# EAGLE board Replicape_B4 (EAGLE 9.5.1), part 1 of 2
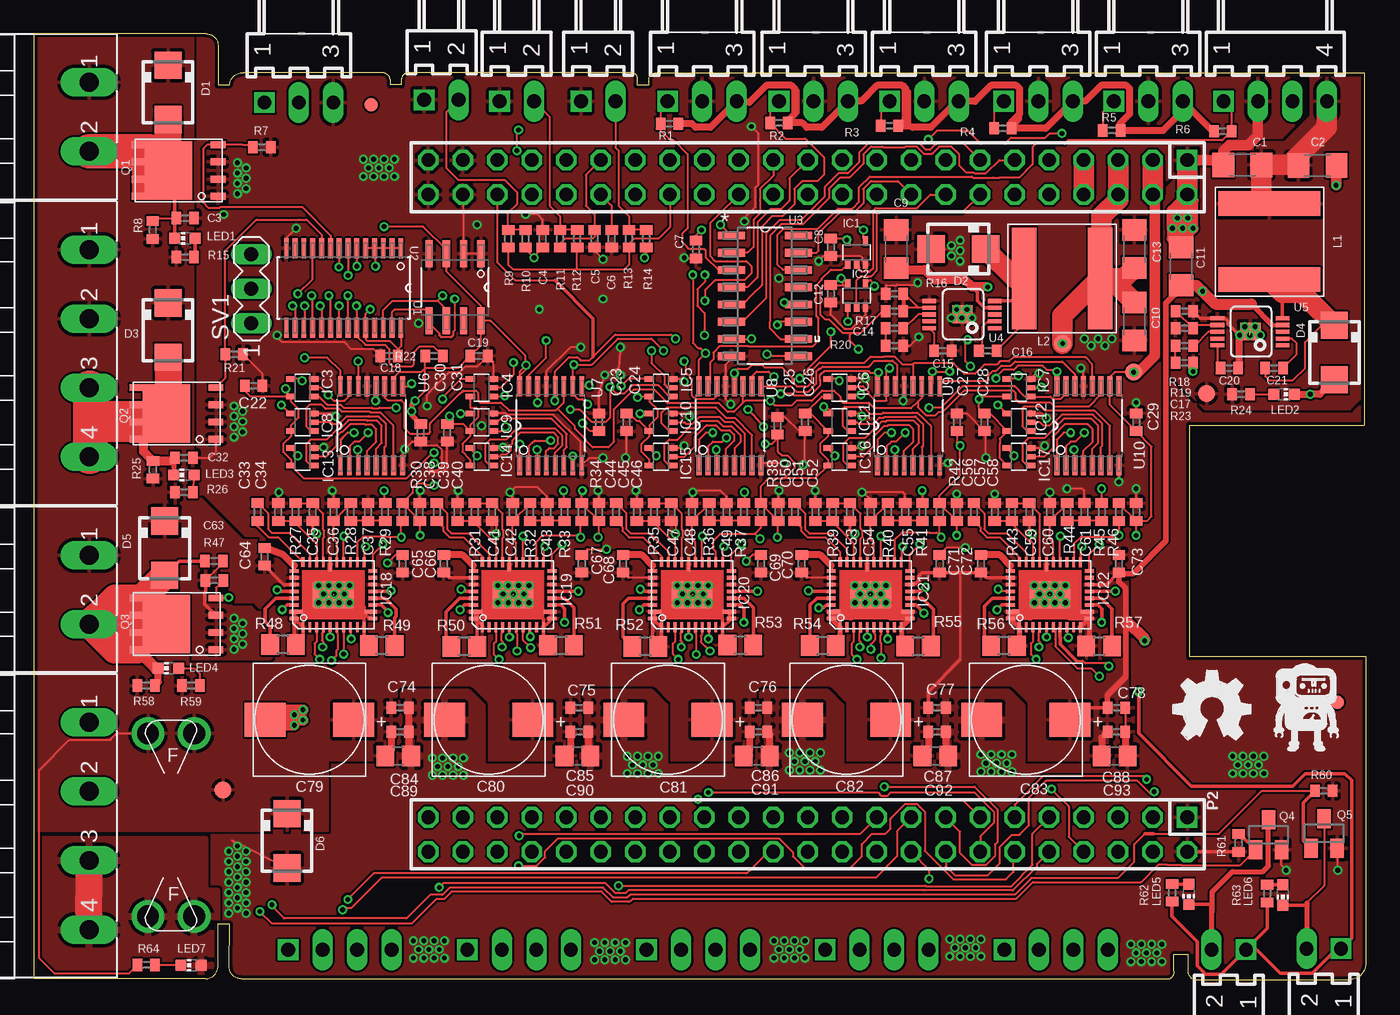
[diagram p7: board, top side]
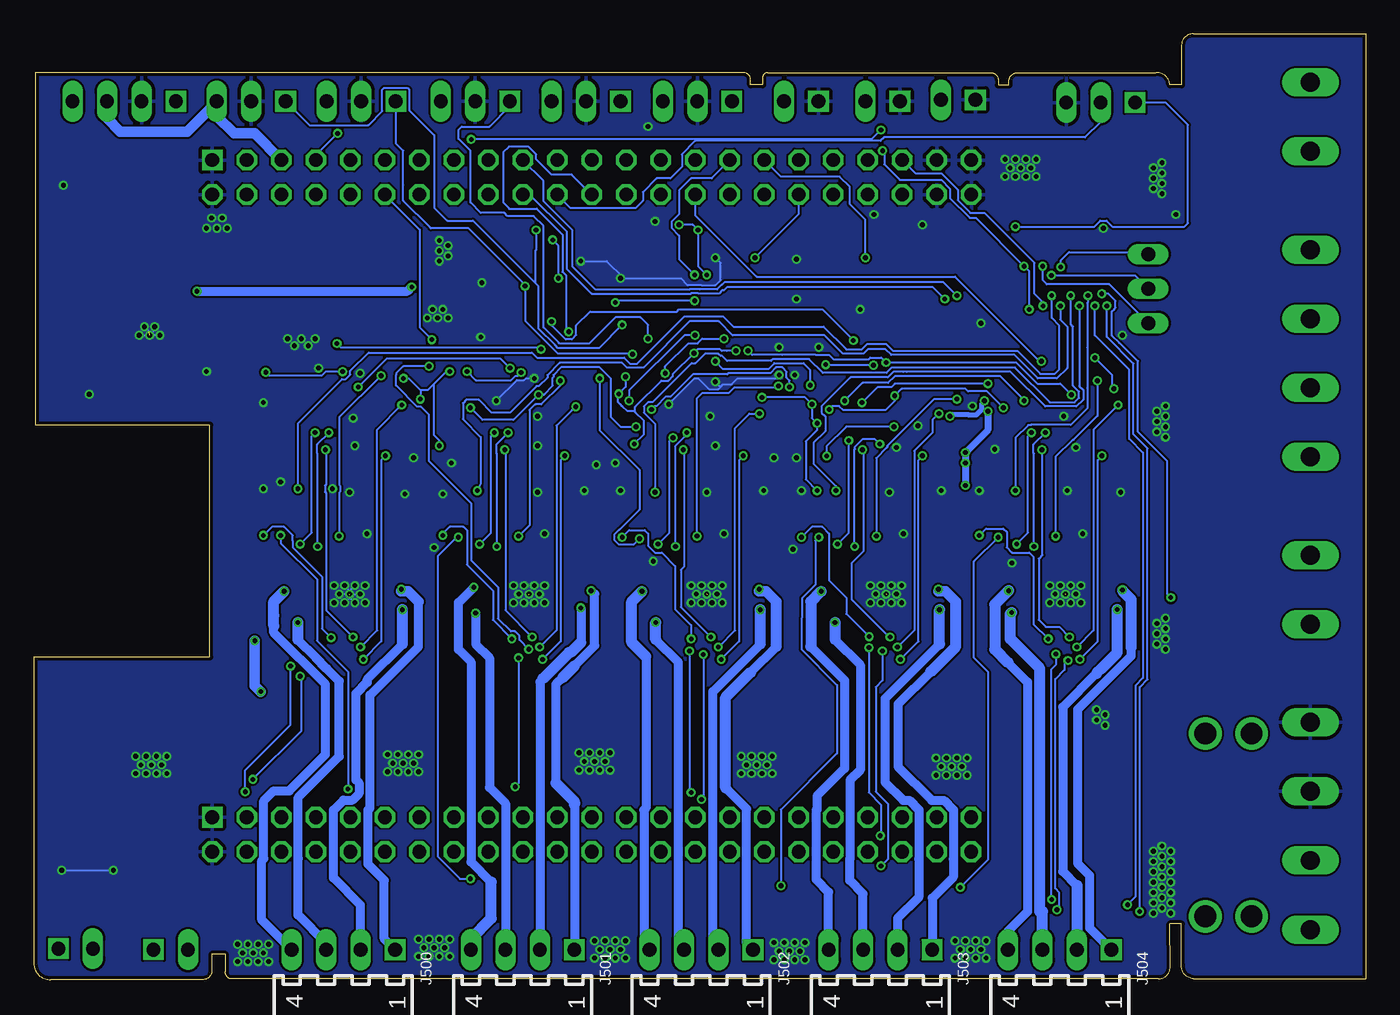
[diagram p8: board, bottom side, seen from below]

Size 98.05 x 69.6 mm. Coordinates in mm from the lower left corner, seen from the top.
Outline: 13.55,4.1 14.4,4.1 14.38,0.9 arc90 15.28,0.05 83.55,0.05 arc90 83.95,0.6 83.95,1.85 84.95,1.85 84.95,0.65 arc90 85.55,0 96.8,0 arc90 98.05,1.1 98.05,23.75 85.1,23.75 85.1,40.8 97.95,40.8 97.95,66.75 45.78,66.75 arc90 45.28,66.2 45.28,65.85 44.4,65.85 44.4,66.35 arc90 44.05,66.75 27.6,66.75 arc90 27.05,66.25 27.05,65.85 26.25,65.85 26.25,66.1 arc90 25.65,66.75 15.45,66.75 arc90 14.4,65.85 13.55,65.85 13.55,68.8 arc90 12.7,69.6 0,69.6 0,0.05 12.7,0.05 arc90 13.55,1.1 13.55,4.1
Copper layers (1*16): Top 0.035mm / dielectric 0.2mm / Bottom 0.035mm
Design rules "default *": minimum track width 6mil, minimum drill 0.3mm, track to track 6mil, track to pad 6mil, pad to pad 6mil, via to via 6mil, smd to smd 0mil, copper to edge 10mil, drill to drill 10mil, minimum pad ring 10mil, minimum via ring 6mil, stop-mask expansion 2mil, vias tented up to drill 100mil, thermal gap 10mil
Net classes: 1 power: width 1.27 mm

## Footprints (pad centres in the part's own frame; a part is rotated, then mirrored left to right if it is on the bottom)
B1,27 = smd 1.27 x 1.27: TP 0,0
C1206 = smd 1.6 x 1.8: 1 -1.4,0; 2 1.4,0
C0402 = smd 0.7 x 0.9: 1 -0.65,0; 2 0.65,0
RHS1V10MCN1GS = smd 3 x 2.5: + -3.25,0; - 3.25,0
C0805 = smd 1.3 x 1.5: 1 -0.95,0; 2 0.95,0
SMA = smd 2 x 2: A 2,0; C -2,0
3557 = drill 1.6: P$1 -6.73,1.7; P$2 -6.73,-1.7; P$3 6.73,-1.7; P$4 6.73,1.7
SC70-5 = smd 0.4 x 0.7: 1 -0.65,-0.85; 2 0,-0.85; 3 0.65,-0.85; 4 0.65,0.85; 5 -0.65,0.85
QFN36-PAD = smd 0.7 x 0.25: 1 -2.4,2.25; 2 -2.4,1.75; 3 -2.4,1.25; 4 -2.4,0.75; 5 -2.4,0.25; 6 -2.4,-0.25; 7 -2.4,-0.75; 8 -2.4,-1.25; 9 -2.4,-1.75; 10 -2.4,-2.25; 19 2.4,-2.25; 20 2.4,-1.75; 21 2.4,-1.25; 22 2.4,-0.75; 23 2.4,-0.25; 25 2.4,0.75; 26 2.4,1.25; 27 2.4,1.75; 28 2.4,2.25 | smd 0.25 x 0.7: 11 -1.75,-2.9; 13 -0.75,-2.9; 14 -0.25,-2.9; 15 0.25,-2.9; 16 0.75,-2.9; 17 1.25,-2.9; 18 1.75,-2.9; 29 1.75,2.9; 30 1.25,2.9; 31 0.75,2.9; 32 0.25,2.9; 33 -0.25,2.9; 34 -0.75,2.9; 36 -1.75,2.9 | smd 0.25 x 1: 12 -1.25,-2.75; 35 -1.25,2.75 | smd 1 x 0.25: 24 2.25,0.25 | smd 2 x 3: TP 0,0
7395-04 = drill 1.016 square: 1 3.81,0 | drill 1.016 long: 2 1.27,0; 3 -1.27,0; 4 -3.81,0
FIDUCIAL-1X2.5 = smd 1 x 1: 1 0,0
NR8040T330 = smd 1.8 x 7.5: P$1 2.8,0; P$2 -2.8,0
CHIP-LED0603 = smd 0.8 x 0.8: A 0,-0.75; C 0,0.75
DIL-100-2X23 = drill 1.016 square: 1 -27.94,-1.27 | drill 1.016 octagon: 2 -27.94,1.27; 3 -25.4,-1.27; 4 -25.4,1.27; 5 -22.86,-1.27; 6 -22.86,1.27; 7 -20.32,-1.27; 8 -20.32,1.27; 9 -17.78,-1.27; 10 -17.78,1.27; 11 -15.24,-1.27; 12 -15.24,1.27; 13 -12.7,-1.27; 14 -12.7,1.27; 15 -10.16,-1.27; 16 -10.16,1.27; 17 -7.62,-1.27; 18 -7.62,1.27; 19 -5.08,-1.27; 20 -5.08,1.27; 21 -2.54,-1.27; 22 -2.54,1.27; 23 0,-1.27; 24 0,1.27; 25 2.54,-1.27; 26 2.54,1.27; 27 5.08,-1.27; 28 5.08,1.27; 29 7.62,-1.27; 30 7.62,1.27; 31 10.16,-1.27; 32 10.16,1.27; 33 12.7,-1.27; 34 12.7,1.27; 35 15.24,-1.27; 36 15.24,1.27; 37 17.78,-1.27; 38 17.78,1.27; 39 20.32,-1.27; 40 20.32,1.27; 41 22.86,-1.27; 42 22.86,1.27; 43 25.4,-1.27; 44 25.4,1.27; 45 27.94,-1.27; 46 27.94,1.27
8-DFN-EP-(5X6) = smd 1.1 x 0.5: 1 -2.9,1.905; 2 -2.9,0.635; 3 -2.9,-0.635; 4 -2.9,-1.905; 5 2.9,-1.905; 6 2.9,-0.635; 7 2.9,0.635; 8 2.9,1.905 | smd 3.5 x 4.3: TH 0.75,0
SOT23 = smd 1 x 1.4: 1 -0.95,-1.1; 2 0.95,-1.1; 3 0,1.1
R0402 = smd 0.7 x 0.9: 1 -0.65,0; 2 0.65,0
R0805 = smd 1.3 x 1.5: 1 -0.95,0; 2 0.95,0
MA03-1 = drill 1.016 long: 1 -2.54,0; 2 0,0; 3 2.54,0
SOP65P640X110-28N = smd 1.473 x 0.356: 1 -2.921,4.216; 2 -2.921,3.581; 3 -2.921,2.921; 4 -2.921,2.286; 5 -2.921,1.626; 6 -2.921,0.965; 7 -2.921,0.33; 8 -2.921,-0.33; 9 -2.921,-0.965; 10 -2.921,-1.626; 11 -2.921,-2.286; 12 -2.921,-2.921; 13 -2.921,-3.581; 14 -2.921,-4.216; 15 2.921,-4.216; 16 2.921,-3.581; 17 2.921,-2.921; 18 2.921,-2.286; 19 2.921,-1.626; 20 2.921,-0.965; 21 2.921,-0.33; 22 2.921,0.33; 23 2.921,0.965; 24 2.921,1.626; 25 2.921,2.286; 26 2.921,2.921; 27 2.921,3.581; 28 2.921,4.216
SOIC127P600X175-8N = smd 1.981 x 0.533: 1 -2.464,1.905; 2 -2.464,0.635; 3 -2.464,-0.635; 4 -2.464,-1.905; 5 2.464,-1.905; 6 2.464,-0.635; 7 2.464,0.635; 8 2.464,1.905
SOIC127P600X175-16N = smd 1.981 x 0.559: 1 -2.464,4.445; 2 -2.464,3.175; 3 -2.464,1.905; 4 -2.464,0.635; 5 -2.464,-0.635; 6 -2.464,-1.905; 7 -2.464,-3.175; 8 -2.464,-4.445; 9 2.464,-4.445; 10 2.464,-3.175; 11 2.464,-1.905; 12 2.464,-0.635; 13 2.464,0.635; 14 2.464,1.905; 15 2.464,3.175; 16 2.464,4.445
MSOP10 = smd 0.3 x 1: 1 -1,-2.4; 2 -0.5,-2.4; 3 0.005,-2.4; 4 0.5,-2.4; 5 1,-2.4; 6 1,2.4; 7 0.5,2.4; 8 0.005,2.4; 9 -0.5,2.4; 10 -1,2.4 | smd 1.3 x 1.5: EP 0.02,-0.04
SOP65P640X120-16N = smd 1.473 x 0.356: 1 -2.921,2.286; 2 -2.921,1.626; 3 -2.921,0.965; 4 -2.921,0.33; 5 -2.921,-0.33; 6 -2.921,-0.965; 7 -2.921,-1.626; 8 -2.921,-2.286; 9 2.921,-2.286; 10 2.921,-1.626; 11 2.921,-0.965; 12 2.921,-0.33; 13 2.921,0.33; 14 2.921,0.965; 15 2.921,1.626; 16 2.921,2.286
7395-03 = drill 1.016 square: 1 2.54,0 | drill 1.016 long: 2 0,0; 3 -2.54,0
7395-02 = drill 1.016 square: 1 1.27,0 | drill 1.016 long: 2 -1.27,0
MSTBA2 = drill 1.397 long: 1 -2.54,5.08; 2 2.54,5.08
MSTBA4 = drill 1.397 long: 1 -7.62,5.08; 2 -2.54,5.08; 3 2.54,5.08; 4 7.62,5.08

## Placement (x,y rotation side)
3.3V  TPB1,27  [B1,27]  80.98,44.7 180 top
5V  TPB1,27  [B1,27]  75.74,46.81 270 top
12..24V  TPB1,27  [B1,27]  13.93,13.96 90 top
12V  TPB1,27  [B1,27]  86.36,43.13 270 top
C1  10uF  [C1206]  88.98,59.97 180 top
C2  10uF  [C1206]  94.51,59.93 0 top
C3  4.7nF  [C0402]  11.12,56.05 0 top
C4  4.7uF  [C0402]  37.47,54.53 90 top
C5  4.7uF  [C0402]  41.27,54.53 270 top
C6  4.7uF  [C0402]  42.55,54.53 270 top
C7  0.1uF  [C0402]  48.76,53.74 270 top
C8  0.1uF  [C0402]  58.67,53.9 270 top
C9  10uF  [C1206]  63.5,53.77 90 top
C10  10uF  [C1206]  81.03,53.77 90 top
C11  10uF  [C1206]  84.45,52.5 90 top
C12  0.1uF  [C0402]  58.67,50.47 270 top
C13  10uF  [C1206]  81.03,48.44 270 top
C14  1nF  [C0402]  63.37,47.93 180 top
C15  10nF  [C0402]  66.93,46.28 0 top
C16  10nF  [C0402]  70.23,46.28 0 top
C17  1nF  [C0402]  84.71,46.66 180 top
C18  0.1uF  [C0402]  26.16,45.9 180 top
C19  0.1uF  [C0402]  32.77,45.9 0 top
C20  10nF  [C0402]  88.01,45.01 0 top
C21  10nF  [C0402]  91.31,45.01 180 top
C22  0.1uF  [C0402]  16.18,43.7 0 top
C23  0.1uF  [C0402]  41.61,41.02 90 top
C24  0.1uF  [C0402]  43.63,41.02 270 top
C25  0.1uF  [C0402]  54.75,40.77 90 top
C26  0.1uF  [C0402]  56.78,41.02 270 top
C27  0.1uF  [C0402]  67.96,41.02 90 top
C28  0.1uF  [C0402]  69.98,41.02 270 top
C29  0.1uF  [C0402]  81.16,41.02 90 top
C30  0.1uF  [C0402]  28.49,40.24 270 top
C31  0.1uF  [C0402]  30.43,40.26 270 top
C32  4.7nF  [C0402]  11.05,38.41 0 top
C33  22nF  [C0402]  16.47,34.42 90 top
C34  0.1uF  [C0402]  18,34.42 90 top
C35  4.7uF  [C0402]  20.54,34.42 90 top
C36  4.7uF  [C0402]  22.06,34.42 90 top
C37  4.7uF  [C0402]  24.6,34.42 90 top
C38  0.1uF  [C0402]  28.41,34.42 90 top
C39  22nF  [C0402]  29.67,34.42 90 top
C40  0.1uF  [C0402]  31.2,34.42 90 top
C41  4.7uF  [C0402]  33.74,34.42 90 top
C42  4.7uF  [C0402]  35.26,34.42 90 top
C43  4.7uF  [C0402]  37.8,34.42 90 top
C44  0.1uF  [C0402]  41.61,34.42 90 top
C45  22nF  [C0402]  42.87,34.42 90 top
C46  0.1uF  [C0402]  44.4,34.42 90 top
C47  4.7uF  [C0402]  46.94,34.42 90 top
C48  4.7uF  [C0402]  48.46,34.42 90 top
C49  4.7uF  [C0402]  51,34.42 90 top
C50  0.1uF  [C0402]  54.81,34.42 90 top
C51  22nF  [C0402]  56.02,34.42 90 top
C52  0.1uF  [C0402]  57.55,34.42 90 top
C53  4.7uF  [C0402]  60.09,34.42 90 top
C54  4.7uF  [C0402]  61.61,34.42 90 top
C55  4.7uF  [C0402]  64.15,34.42 90 top
C56  0.1uF  [C0402]  67.96,34.42 90 top
C57  22nF  [C0402]  69.22,34.42 90 top
C58  0.1uF  [C0402]  70.75,34.42 90 top
C59  4.7uF  [C0402]  73.29,34.42 90 top
C60  4.7uF  [C0402]  74.81,34.42 90 top
C61  4.7uF  [C0402]  77.35,34.42 90 top
C62  0.1uF  [C0402]  81.16,34.42 90 top
C63  4.7nF  [C0402]  13.25,30.81 0 top
C64  0.1uF  [C0402]  16.98,31.11 270 top
C65  0.1uF  [C0402]  27.14,30.61 270 top
C66  0.1uF  [C0402]  30.18,30.61 270 top
C67  0.1uF  [C0402]  40.34,30.61 270 top
C68  0.1uF  [C0402]  43.38,30.61 270 top
C69  0.1uF  [C0402]  53.54,30.61 270 top
C70  0.1uF  [C0402]  56.53,30.61 270 top
C71  0.1uF  [C0402]  66.69,30.61 270 top
C72  0.1uF  [C0402]  69.73,30.61 270 top
C73  0.1uF  [C0402]  79.89,30.61 270 top
C74  0.1uF  [C0402]  26.95,20.01 0 top
C75  0.1uF  [C0402]  40.15,20.01 0 top
C76  0.1uF  [C0402]  53.35,20.01 0 top
C77  0.1uF  [C0402]  66.5,20.01 0 top
C78  0.1uF  [C0402]  79.7,20.01 0 top
C79  100uF  [RHS1V10MCN1GS]  20.28,19.11 180 top
C80  100uF  [RHS1V10MCN1GS]  33.48,19.11 180 top
C81  100uF  [RHS1V10MCN1GS]  46.68,19.11 180 top
C82  100uF  [RHS1V10MCN1GS]  59.83,19.11 180 top
C83  100uF  [RHS1V10MCN1GS]  73.03,19.11 180 top
C84  0.1uF  [C0402]  26.95,18.23 0 top
C85  0.1uF  [C0402]  40.15,18.23 0 top
C86  0.1uF  [C0402]  53.35,18.23 0 top
C87  0.1uF  [C0402]  66.5,18.23 0 top
C88  0.1uF  [C0402]  79.7,18.23 0 top
C89  10uF  [C0805]  26.83,16.45 0 top
C90  10uF  [C0805]  40.02,16.45 0 top
C91  10uF  [C0805]  53.23,16.45 0 top
C92  10uF  [C0805]  66.38,16.45 0 top
C93  10uF  [C0805]  79.57,16.45 0 top
D1  MBRA340T3  [SMA]  9.88,65.3 270 top
D2  MBRA340T3  [SMA]  68.07,53.77 180 top
D3  MBRA340T3  [SMA]  9.88,47.8 270 top
D4  MBRA340T3  [SMA]  95.76,46.15 270 top
D5  MBRA340T3  [SMA]  9.62,31.75 270 top
D6  MBRA340T3  [SMA]  18.64,10.21 270 top
F1  FUSE  [3557]  10.1,11.38 90 top
FH1  FUSE-HOLDER  [FUSE-HOLDER]  9.8,16.03 0 top
FH2  FUSE-HOLDER  [FUSE-HOLDER]  9.85,5.8 0 top
IC1  74AHC1G126DCK  [SC70-5]  60.58,53.52 0 top
IC2  74AHC1G126DCK  [SC70-5]  60.58,50.34 0 top
IC3  74AHC1G126DCK  [SC70-5]  19.77,43.56 90 top
IC4  74AHC1G126DCK  [SC70-5]  32.97,43.56 90 top
IC5  74AHC1G126DCK  [SC70-5]  46.17,43.56 90 top
IC6  74AHC1G126DCK  [SC70-5]  59.32,43.56 90 top
IC7  74AHC1G126DCK  [SC70-5]  72.52,43.56 90 top
IC8  74AHC1G126DCK  [SC70-5]  19.77,41.02 90 top
IC9  74AHC1G126DCK  [SC70-5]  32.97,41.02 90 top
IC10  74AHC1G126DCK  [SC70-5]  46.17,41.02 90 top
IC11  74AHC1G126DCK  [SC70-5]  59.32,41.02 90 top
IC12  74AHC1G126DCK  [SC70-5]  72.52,41.02 90 top
IC13  74AHC1G126DCK  [SC70-5]  19.77,38.48 90 top
IC14  74AHC1G126DCK  [SC70-5]  32.97,38.48 90 top
IC15  74AHC1G126DCK  [SC70-5]  46.17,38.48 90 top
IC16  74AHC1G126DCK  [SC70-5]  59.32,38.48 90 top
IC17  74AHC1G126DCK  [SC70-5]  72.52,38.48 90 top
IC18  TMC2100-LA  [QFN36-PAD]  22.06,28.32 90 top
IC19  TMC2100-LA  [QFN36-PAD]  35.26,28.32 90 top
IC20  TMC2100-LA  [QFN36-PAD]  48.46,28.32 90 top
IC21  TMC2100-LA  [QFN36-PAD]  61.61,28.32 90 top
IC22  TMC2100-LA  [QFN36-PAD]  74.81,28.32 90 top
J500  22-05-7048-04  [7395-04]  75.27,2.19 0 bottom
J501  22-05-7048-04  [7395-04]  62.07,2.19 0 bottom
J502  22-05-7048-04  [7395-04]  48.92,2.19 0 bottom
J503  22-05-7048-04  [7395-04]  35.72,2.19 0 bottom
J504  22-05-7048-04  [7395-04]  22.52,2.19 0 bottom
JP1  FIDUCIAL1X2.5  [FIDUCIAL-1X2.5]  24.83,64.38 0 top
JP2  FIDUCIAL1X2.5  [FIDUCIAL-1X2.5]  95.95,20.4 0 top
L1  33uH  [NR8040T330]  90.98,54.31 90 top
L2  33uH  [NR8040T330]  75.7,51.6 0 top
LED1  blue  [CHIP-LED0603]  11.12,54.55 90 top
LED2  blue  [CHIP-LED0603]  92.04,43.08 270 top
LED3  blue  [CHIP-LED0603]  11.05,37.14 90 top
LED4  blue  [CHIP-LED0603]  9.91,22.91 90 top
LED5  blue  [CHIP-LED0603]  85.03,6.28 180 top
LED6  blue  [CHIP-LED0603]  91.95,6.23 180 top
LED7  blue  [CHIP-LED0603]  11.57,1.05 90 top
LOGO1  OSHW_LOGO_FILLX0200-NT  [OSHW_FILLX200_NOTEXT]  83.91,17.66 0 top
P1  F-2X23-  [DIL-100-2X23]  56.98,59.05 180 top
P2  F-2X23-  [DIL-100-2X23]  56.98,10.68 180 top
Q1  AON6758  [8-DFN-EP-(5X6)]  10.65,59.55 180 top
Q2  AON6758  [8-DFN-EP-(5X6)]  10.5,41.68 180 top
Q3  AON6758  [8-DFN-EP-(5X6)]  10.5,26.18 180 top
Q4  [SOT23]  90.9,10.65 0 top
Q5  [SOT23]  95,10.75 0 top
R1  4.7K  [R0402]  46.8,63 0 top
R2  4.7K  [R0402]  54.85,63.05 0 top
R3  4.7K  [R0402]  63,62.85 0 top
R4  4.7K  [R0402]  71.35,62.65 0 top
R5  4.7K  [R0402]  79.35,62.5 0 top
R6  4.7K  [R0402]  87.53,62.44 180 top
R7  4.7K  [R0402]  16.79,61.26 180 top
R8  4.7K  [R0402]  8.75,55.18 270 top
R9  4K7, 1%  [R0402]  34.93,54.53 270 top
R10  10K  [R0402]  36.2,54.53 270 top
R11  10K  [R0402]  38.73,54.53 270 top
R12  4K7, 1%  [R0402]  40.01,54.53 270 top
R13  4K7, 1%  [R0402]  43.82,54.53 270 top
R14  10K  [R0402]  45.09,54.53 270 top
R15  4.7K  [R0402]  11.12,53.18 180 top
R16  10K,1%  [R0402]  63.37,50.47 180 top
R17  44.3K,1%  [R0402]  63.37,49.2 0 top
R18  10K,1%  [R0402]  84.71,49.2 0 top
R19  120K,1%  [R0402]  84.71,47.93 0 top
R20  39K  [R0402]  63.37,46.66 0 top
R21  4.7K  [R0402]  14.74,46.02 180 top
R22  4.7K  [R0402]  29.46,45.9 180 top
R23  39K  [R0402]  84.71,45.39 0 top
R24  4.7K  [R0402]  88.89,43.08 180 top
R25  4.7K  [R0402]  8.76,37.52 270 top
R26  4.7K  [R0402]  11.05,35.87 180 top
R27  2.2R  [R0402]  19.27,34.42 270 top
R28  10K  [R0402]  23.33,34.42 270 top
R29  10K  [R0402]  25.87,34.42 90 top
R30  4.7K  [R0402]  27.14,34.42 90 top
R31  2.2R  [R0402]  32.47,34.42 270 top
R32  10K  [R0402]  36.53,34.42 270 top
R33  10K  [R0402]  39.07,34.42 90 top
R34  4.7K  [R0402]  40.34,34.42 90 top
R35  2.2R  [R0402]  45.67,34.42 270 top
R36  10K  [R0402]  49.73,34.42 270 top
R37  10K  [R0402]  52.27,34.42 90 top
R38  4.7K  [R0402]  53.54,34.42 90 top
R39  2.2R  [R0402]  58.82,34.42 270 top
R40  10K  [R0402]  62.88,34.42 270 top
R41  10K  [R0402]  65.42,34.42 90 top
R42  4.7K  [R0402]  66.69,34.42 90 top
R43  2.2R  [R0402]  72.02,34.42 270 top
R44  10K  [R0402]  76.08,34.42 270 top
R45  10K  [R0402]  78.62,34.42 90 top
R46  4.7K  [R0402]  79.89,34.42 90 top
R47  4.7K  [R0402]  13.28,29.38 0 top
R48  0.1R  [R0805]  18.34,24.65 180 top
R49  0.1R  [R0805]  25.6,24.6 0 top
R50  0.1R  [R0805]  31.68,24.52 180 top
R51  0.1R  [R0805]  38.81,24.61 0 top
R52  0.1R  [R0805]  45.01,24.51 180 top
R53  0.1R  [R0805]  52.02,24.62 0 top
R54  0.1R  [R0805]  58.09,24.58 180 top
R55  0.1R  [R0805]  65.1,24.55 0 top
R56  0.1R  [R0805]  71.43,24.57 180 top
R57  0.1R  [R0805]  78.43,24.56 0 top
R58  4.7K  [R0402]  8.25,21.64 180 top
R59  4.7K  [R0402]  11.56,21.64 180 top
R60  4.7K  [R0402]  94.98,13.89 180 top
R61  4.7K  [R0402]  88.7,10.05 90 top
R62  4.7K  [R0402]  83.8,6.38 270 top
R63  4.7K  [R0402]  90.8,6.33 270 top
R64  4.7K  [R0402]  8.28,1.08 0 top
SV1  [MA03-1]  16,50.85 90 top
U1  PCA9685PW  [SOP65P640X110-28N]  22.8,50.9 270 top
U2  CAT24C256  [SOIC127P600X175-8N]  31,50.95 270 top
U3  CD4050BD  [SOIC127P600X175-16N]  53.83,50.32 0 top
U4  RT8268  [MSOP10]  68.33,48.95 90 top
U5  RT8268  [MSOP10]  89.53,47.68 90 top
U6  SN74AHC595PW  [SOP65P640X120-16N]  24.85,40.77 90 top
U7  SN74AHC595PW  [SOP65P640X120-16N]  38.05,40.77 90 top
U8  SN74AHC595PW  [SOP65P640X120-16N]  51.25,40.77 90 top
U9  SN74AHC595PW  [SOP65P640X120-16N]  64.4,40.77 90 top
U10  SN74AHC595PW  [SOP65P640X120-16N]  77.6,40.77 90 top
U$1  CC-BY-SA  [CC-BY-SA]  22.35,58.7 0 top
U$2  [LOGO_BIG]  93.25,20.1 0 top
X1  22-05-7038-03  [7395-03]  19.5,64.55 180 top
X2  22-05-7028-02  [7395-02]  30,64.75 180 top
X3  22-05-7028-02  [7395-02]  35.55,64.65 180 top
X4  22-05-7028-02  [7395-02]  41.55,64.65 180 top
X5  22-05-7038-03  [7395-03]  49.2,64.65 180 top
X6  22-05-7038-03  [7395-03]  57.4,64.65 180 top
X7  22-05-7038-03  [7395-03]  65.55,64.65 180 top
X8  22-05-7038-03  [7395-03]  73.95,64.65 180 top
X9  22-05-7038-03  [7395-03]  82.05,64.65 180 top
X10  22-05-7048-04  [7395-04]  91.4,64.65 180 top
X11  MSTBA2  [MSTBA2]  -1.02,63.5 270 top
X12  MSTBA4  [MSTBA4]  -1.02,46.1 270 top
X13  MSTBA2  [MSTBA2]  -1.02,28.7 270 top
X14  MSTBA4  [MSTBA4]  -1.02,11.3 270 top
X15  22-05-7028-02  [7395-02]  87.98,2.2 0 top
X16  22-05-7028-02  [7395-02]  94.98,2.28 0 top
XC1  MSTBV2-CONNECTOR  [MSTBA2-CONNECTOR]  -7.62,63.5 90 top  (outside the outline)
XC2  MSTBA4-CONNECTOR  [MSTBA4-CONNECTOR]  -7.65,46.05 90 top  (outside the outline)
XC3  MSTBV2-CONNECTOR  [MSTBA2-CONNECTOR]  -7.65,28.65 90 top  (outside the outline)
XC4  MSTBA4-CONNECTOR  [MSTBA4-CONNECTOR]  -7.62,11.28 90 top  (outside the outline)

## Tracks (layer width: path | path; a pad name or v marks a point on that pad's centre or on a via)
+3V3  (via drill 0.35)
  Top 0.152: C62.1 79.89,35.04 R46.2 | C50.1 | C50.1 53.54,35.04 R38.2 53.54,36.32 54.1,36.88 55.12,36.88 | IC3.5 15.94,42.91 15.53,43.32 C22.1 | IC18.8 23.31,25.13 v23.37,25.07 | v28.45,32.69 28.45,33.73 | 28.45,33.73 C38.1 | IC19.8 36.51,25.28 v36.55,25.24 | v41.53,32.56 41.61,32.64 C44.1 40.34,35.04 R34.2 40.34,35.95 v40.39,35.99 | IC20.8 49.71,25.12 v49.66,25.07 | v54.74,32.56 54.8,32.63 C50.1 | IC21.8 v62.86,25.08 v62.87,25.07 | v67.94,32.69 67.94,33.75 C56.1 66.69,35.04 R42.2 66.69,35.63 68.2,37.14 v68.2,39.29 67.96,39.53 C27.1 | IC22.8 76.06,25.28 v76.17,25.17 | v81.15,32.69 v81.16,32.7 C62.1 | U10.16 v75.32,44.75 75.18,44.88 74.57,44.88 74.27,45.18 72.44,45.18 72.14,44.88 71.37,44.88 70.74,44.25 v70.84,44.25 | U9.10 66.17,43.82 v66.17,44.76 v67.44,44.76 | U2.8 33.61,48.49 36.2,45.9 36.2,44.88 35.77,44.46 U7.16 35.77,44.74 v36.24,45.21 | C25.1 54.8,40.06 54.8,39.87 | 54.8,39.87 54.36,39.42 v53.85,39.42 | C7.1 48.76,54.78 v49.15,55.17 | v50.55,55.55 51.33,54.77 U3.1 | v48.51,51.87 48.51,46.87 48.9,46.49 49.07,46.49 v49.46,46.1 48.97,45.61 U8.16 | 46.29,46.34 v46.36,46.28 45.47,47.17 43,47.17 41.09,45.26 v39.75,45.26 39.68,45.19 U7.10 39.68,43.11 40.07,42.72 40.39,42.72 v40.77,42.34 | 46.29,46.34 46.23,46.41 46.29,46.34 | IC10.5 44.59,41.1 44.39,41.1 43.82,41.67 C24.1 | IC10.5 45.32,40 44.75,39.43 44.75,38.84 45.32,38.26 IC15.5 | C23.1 40.96,40.37 v40.39,40.95 | U2.8 32.91,49.57 30.37,52.11 U2.3 30.37,53.73 28.67,55.42 v25.78,55.42 | C62.1 81.97,33.77 82.3,34.09 82.3,39.23 C29.1 79.23,42.3 U10.10 79.23,44.36 79.58,44.7 3.3V.TP | IC6.5 58.02,42.91 C26.1 57.17,41.67 IC11.5 58.47,40 57.9,39.43 57.9,38.84 58.47,38.26 IC16.5 57.52,36.88 55.12,36.88
  Top 0.152: IC17.5 71.09,38.41 71.09,39.43 71.12,39.45 71.12,39.82 IC12.5 70.37,41.67 C28.1 69.6,42.06 v69.6,42.72 69.78,42.91 IC7.5 | IC9.5 32.12,40 31.55,39.43 31.55,38.84 32.12,38.26 IC14.5 | C31.1 31.59,40.91 IC9.5 | IC3.5 18.92,42.54 19.5,41.97 19.5,41.38 18.92,40.8 IC8.5 18.92,40 18.35,39.43 18.35,38.84 18.92,38.26 IC13.5 19.87,36.88 27.43,36.88 29.34,38.79 v29.46,38.79 | IC4.5 32.12,42.1 32.57,42.1 32.7,41.97 32.7,41.38 32.12,40.8 IC9.5 | v44.45,42.85 44.51,42.91 IC5.5 45.32,42.54 45.9,41.97 45.9,41.38 45.32,40.8 IC10.5 | v28.07,42.6 28.81,43.34 28.81,45.01 | 28.81,45.01 R22.2 | U6.10 26.48,44.31 26.92,44.76 28.56,44.76 28.81,45.01 | 28.81,45.01 31.23,45.01 C19.1 32.91,46.69 U2.8 | U6.16 22.57,44.79 21.59,45.77 v19.94,45.77 | v18.54,43.49 18.54,43.29 IC3.5 | v29.46,36.37 28.85,36.37 28.71,36.51 | 28.68,36.55 28.71,36.51 | 55.12,36.88 55.25,36.88 56.01,37.64 56.01,38.05 55.48,38.58 55.07,38.58 54.8,38.85 54.8,39.87 | 28.45,33.73 28.45,33.76 R30.2 27.89,35.82 27.89,36.22 28.22,36.55 28.68,36.55 | U8.10 52.88,44.42 53.21,44.76 54.1,44.76 v54.48,44.37 | 28.68,36.55 28.71,36.51 | v54.99,43.11 55.88,43.11 56.01,42.98 57.15,42.98 57.9,43.72 57.9,44.12 57.9,44.51 57.97,44.58 58.19,44.8 60.83,44.8 | 61.44,44.8 61.57,44.68 | 60.83,44.8 61.44,44.8 | 61.44,44.8 61.57,44.68 | 61.57,44.68 v62.18,44.68 62.12,44.62 U9.16 | 60.83,44.8 61.44,44.8
  Top 0.381: C30.1 27.81,41.56 v27.81,41.83 27.81,42.34 v28.07,42.6 | v30.61,41.45 30.61,41.08 C31.1
  Top 0.762: P1.4 82.55,57.61 82.55,50.72 82.55,45.9 81.23,44.58 3.3V.TP
  Top 1.524: P1.3 P1.4
  Bottom 0.152: v28.45,32.69 27.94,33.2 26.67,33.2 26.42,32.94 26.42,31.8 26.04,31.42 24.77,31.42 24.45,31.1 24.45,27.17 24.45,26.15 v23.37,25.07 | v41.53,32.56 40.77,33.33 40.01,33.33 39.5,32.82 39.5,29.39 38.23,28.12 38.23,26.92 v36.55,25.24 | v49.66,25.07 49.66,26.09 50.83,27.26 50.83,30.44 51.82,31.42 52.32,31.42 52.83,31.93 52.83,32.82 53.09,33.07 54.23,33.07 v54.74,32.56 | v62.87,25.07 64.26,26.47 64.26,28.63 66.17,30.53 66.17,33.07 66.42,33.33 67.44,33.33 67.94,32.82 v67.94,32.69 | v81.15,32.69 80.52,33.33 79.63,33.33 78.99,32.69 78.99,32.29 79,32.28 79,31.82 76.83,29.66 76.83,25.83 v76.17,25.17 | 69.6,43.38 v69.6,42.72 | v39.75,45.26 36.29,45.26 v36.24,45.21 | v68.2,39.29 68.2,39.68 68.58,40.06 68.58,43.87 | v67.44,44.76 67.69,44.76 68.58,43.87 | v53.85,39.42 53.16,40.1 53.16,41.15 53.78,41.77 | 53.78,41.77 53.85,41.83 54.36,41.83 54.74,42.22 54.86,42.34 54.88,42.34 55.04,42.5 55.04,43.06 v54.99,43.11 54.48,43.62 v54.48,44.37 | v50.55,55.55 49.53,55.55 v49.15,55.17 49.15,52.5 v48.51,51.87 | v75.32,44.75 76.56,44.75 76.86,44.45 80.72,44.45 81.03,44.76 3.3V.TP | 68.58,43.87 69.07,43.38 69.6,43.38 | v19.94,45.77 18.67,44.5 18.67,43.49 v18.54,43.49 | 53.78,41.77 53.78,42.15 51.86,44.08 51.34,44.08 51.02,44.4 51.02,44.54 v49.46,46.1 49.18,46.38 47.52,46.38 47.42,46.28 47.05,46.28 v46.36,46.28 | v25.78,55.42 19.96,55.42 19.53,55.85 19.07,55.85 18.65,55.42 13.33,55.42 13.08,55.68 13.08,62.92 14.73,64.57 14.75,64.55 X1.1 | v66.17,44.76 65.53,44.12 62.91,44.12 62.61,44.43 62.43,44.43 v62.18,44.68 | v44.45,42.85 41.27,42.85 v40.77,42.34 40.77,41.33 v40.39,40.95 40.39,40.44 41.21,39.61 41.21,36.82 v40.39,35.99
  Bottom 0.152: v70.84,44.25 70.46,44.25 69.6,43.38
  Bottom 0.381: v28.07,42.6 28.29,42.38 28.29,41.94 28.68,41.55 29.23,41.55 29.27,41.58 30.48,41.58 v30.61,41.45
  Bottom 0.508: v27.81,41.83 27.81,40.44 v29.46,38.79 v29.46,38.02 v29.46,36.37
  other vias: 80.98,44.7
DALLAS_W1
  Bottom 0.152: X1.2 19.5,63.16 20.67,61.99 35.44,61.99 35.71,61.72 49.36,61.72 50.35,60.73 50.35,59.81 51.18,58.98 52.2,58.98 53.21,57.96 53.21,57.33 53.75,56.79 58.53,56.79 P1.22
DIR_E  (via drill 0.35)
  Top 0.152: P2.15 68.2,10.89 68.2,9.32 69.11,8.42 70.09,8.42 70.79,9.12 70.79,9.96 70.97,10.14 70.97,12.48 69.26,14.2 v62.61,14.2 | IC21.7 62.36,25.35 62.31,25.3 62.31,24.84 62.36,24.79 v62.36,23.67
  Bottom 0.152: v62.61,14.2 62.36,14.45 v62.36,23.67
DIR_H  (via drill 0.35)
  Top 0.152: 73.28,11.35 72.58,10.66 | 73.28,11.35 73.28,13.39 74.55,14.66 81.22,14.66 82.17,13.7 82.36,13.7 v82.49,13.83 | 72.14,10.66 72.01,10.66 71.12,9.77 71.12,8.56 70.23,7.67 67.82,7.67 67.14,8.35 P2.16 | 72.14,10.66 72.58,10.66 | 72.14,10.66 72.58,10.66 | 72.58,10.66 73.28,11.35 | 76.76,23.48 77.23,23.48 77.44,23.27 78.95,23.27 v79.15,23.07
  Top 0.254: IC22.7 75.56,25.19 75.56,25.18 75.56,24.68 76.76,23.48
  Bottom 0.152: v82.49,13.83 82.49,15.42 79.2,18.71 79.2,23.02 v79.15,23.07
DIR_X  (via drill 0.35)
  Top 0.152: IC18.7 v22.81,23.95 | P2.26 54.09,9.41 52.49,7.81 25.03,7.81 v23.11,5.89
  Bottom 0.152: v23.11,5.89 23.11,5.97 23.16,5.97 23.16,22.81 22.81,23.17 v22.81,23.95
DIR_Y  (via drill 0.35)
  Top 0.152: P2.19 60.81,10.7 52.2,10.7 35.84,10.7 v35.73,10.59 | IC19.7 36.01,25.49 35.99,25.47 35.99,25.01 36.32,24.69 36.33,24.69 v36.58,24.44
  Bottom 0.152: v36.58,24.44 36.58,13.77 35.67,12.86 35.67,10.66 v35.73,10.59
DIR_Z  (via drill 0.35)
  Top 0.152: P2.14 69.68,10.55 70.67,11.54 70.67,12.36 69.26,13.77 63.09,13.77 62.84,13.52 62.38,13.52 62.13,13.77 v49.66,13.77 | IC20.7 49.21,25.41 49.1,25.3 49.1,24.84 49.43,24.51 49.45,24.51 v49.78,24.18
  Bottom 0.152: v49.78,24.18 49.78,13.89 v49.66,13.77
E_A1  (via drill 0.35)
  Top 0.254: IC21.34 58.68,27.54 58.32,27.54 58.14,27.36 v57.79,27.36
  Bottom 0.66: v57.79,27.36 57.79,24.82 | 60.57,22.14 60.8,21.91 J501.2
  Bottom 0.813: 57.79,24.82 58.55,24.05 58.66,24.05 60.57,22.14
E_A2  (via drill 0.35)
  Top 0.254: IC21.32 57.08,28.57 v57.02,28.63
  Bottom 0.66: v57.02,28.63 56.77,28.37 56.77,24.58 58.26,23.09 | 58.26,12.88 J501.1 | 59.13,22.22 59.63,21.72 59.63,14.47
  Bottom 0.813: 58.26,23.09 59.13,22.22 | 59.63,14.47 58.26,13.1 58.26,12.88
E_B1  (via drill 0.35)
  Top 0.254: IC21.13 64.94,27.57 v65.53,26.98
  Bottom 0.66: v65.53,26.98 65.53,24.69 64.52,23.67 64.52,14.15 63.34,12.97 J501.3
E_B2  (via drill 0.35)
  Top 0.254: IC21.15 65.35,28.57 v65.66,28.88
  Bottom 0.66: v65.66,28.88 66.8,27.74 66.8,24.31 65.88,23.39 65.88,8.66 64.39,7.16
  Bottom 0.813: J501.4 65.88,3 64.39,4.5 64.39,7.16
EN_EH  (via drill 0.35)
  Top 0.152: IC7.2 74.12,43.56 v74.17,43.61 | IC6.2 60.53,43.56 60.64,43.68 61.05,43.68 61.45,43.28 61.45,43.12 61.97,42.6 62.74,42.6 62.78,42.64 U9.15 62.78,44.8 v62.99,45.01
  Bottom 0.152: v74.17,43.61 72.09,45.69 63.68,45.69 v62.99,45.01
EN_XYZ  (via drill 0.35)
  Top 0.152: U6.15 23.23,42.98 22.87,42.62 22.08,42.62 v21.65,43.04 21.13,43.56 IC3.2 | v45.47,46.28 45.47,45.38 46.42,44.43 46.42,43.8 46.66,43.56 IC5.2 | IC4.2 34.37,43.56 35.31,44.5 v35.31,45.42
  Bottom 0.152: v21.65,43.04 22.48,43.87 24.18,43.87 25.73,45.42 v35.31,45.42 35.66,45.77 36.47,45.77 36.57,45.67 39.19,45.67 39.5,45.98 40.49,45.98 40.52,46.01 42.92,46.01 42.95,45.98 45.16,45.98 v45.47,46.28
ENABLE  (via drill 0.35)
  Top 0.152: v23.75,49.58 23.75,48 U1.23 23.77,47.35 24.41,46.71 24.69,46.71 25.86,46.71 26.16,46.41 26.16,45.39 26.42,45.14 27.81,45.14 27.94,45.26 27.94,46.15 27.95,46.15 28.37,46.58 29.44,46.58 R22.1
  Bottom 0.152: v23.75,49.58 23.75,49.84 24.38,50.47 24.38,52.76 28.07,56.44 29.1,56.44 30.03,57.37 30.03,58.12 31.24,59.33 33.13,59.33 P1.41
ENABLE_E  (via drill 0.35)
  Top 0.152: IC21.22 62.36,32.63 v62.37,32.64 | v59.29,44.07 59.15,44.21 IC6.4
  Bottom 0.152: v62.37,32.64 61.57,33.44 61.57,41.93 61.16,42.34 61.09,42.34 60.71,42.34 59.29,43.76 v59.29,44.07
ENABLE_H  (via drill 0.35)
  Top 0.152: IC22.22 75.56,32.63 v75.57,32.64 | v72.49,44.45 72.35,44.21 IC7.4
  Bottom 0.152: v72.49,44.45 75.57,41.37 75.57,36.4 75.52,36.35 75.52,35.89 75.57,35.83 v75.57,32.64
ENABLE_X  (via drill 0.35)
  Top 0.152: IC18.22 22.81,32.63 v22.82,32.64 | v19.74,44.07 19.6,44.21 IC3.4
  Bottom 0.152: v19.74,44.07 19.74,41.48 21.5,39.72 21.57,39.72 22.82,38.47 v22.82,32.64
ENABLE_Y  (via drill 0.35)
  Top 0.152: IC19.22 36.01,32.63 v36.02,32.64 | v30.1,42.72 30.1,42.85 31.46,44.21 IC4.4
  Bottom 0.152: 35.21,39.19 35.27,39.13 | 35.27,39.13 35.21,39.19 | 35.21,39.19 35.21,39.29 31.77,42.72 v30.1,42.72 | 35.27,39.13 36.02,38.38 v36.02,32.64
ENABLE_Z  (via drill 0.35)
  Top 0.152: IC20.22 49.21,32.63 v49.22,32.64 | v43.22,43.69 43.27,43.71 43.77,44.21 IC5.4
  Bottom 0.152: v49.22,32.64 49.22,42.8 48.86,43.16 46.91,43.16 46.51,43.56 43.35,43.56 v43.22,43.69
END_STOP_X_1
  Top 0.152: U3.2 52.56,53.5 52.98,53.92 52.98,55.93 53.47,56.42 53.47,57.35 53.45,57.37 53.45,58.19 54.44,59.18 P1.25
END_STOP_X_1_IN
  Top 0.152: X5.1 46.15,64.14 R1.1 46.15,62.48 46.86,61.77 47.12,61.77 48.13,60.76 48.13,55.3 47.75,54.92 47.75,54.28 48.08,53.96 48.08,53.95 48.25,53.77 49.35,53.77 49.48,53.65 49.48,53.14 50.39,52.23 U3.3
END_STOP_X_2
  Top 0.152: P1.11 71.08,60.32 70.09,59.33 69.72,59.33 69.27,59.33 69.19,59.41 68.63,59.41 68.13,59.91 68.13,60.73 67.55,61.31 66.67,61.31 66.15,60.79 66.15,60.76 65.56,60.76 65.01,61.31 64.19,61.31 64.14,61.27 62.52,61.27 62.47,61.31 61.65,61.31 61.07,60.73 61.07,60.04 60.05,59.03 59.36,59.03 58.53,58.19 58.53,57.5 56.61,55.58 55.02,55.58 54.22,54.78 54.22,48.45 54.18,48.41 54.18,47.95 54.99,47.15 U3.10
END_STOP_X_2_IN  (via drill 0.35)
  Top 0.152: X8.1 70.7,63.94 R4.1 | IC2.4 61.52,51.48 61.59,51.48 61.89,51.18 v61.89,51.04 | U3.9 54.12,45.88 v53.98,46.03
  Bottom 0.152: X8.1 71.37,64.61 71.37,61.52 70.87,61.01 70.87,58.47 70.87,57.33 68.9,55.36 68.83,55.3 66.04,55.3 61.98,51.23 61.98,51.11 61.91,51.04 | 61.91,51.04 61.85,50.98 61.85,48.44 59.49,46.08 54.03,46.08 v53.98,46.03 | 61.91,51.04 v61.89,51.04
END_STOP_Y_1
  Top 0.152: P1.23 55.63,58.97 55.63,57.33 54.99,56.69 54.23,56.69 53.29,55.75 53.29,51.69 52.56,50.96 U3.4
END_STOP_Y_1_IN
  Top 0.152: X6.1 54.2,63.99 R2.1 55.35,61.9 56.8,61.9 58.17,60.53 58.17,59.23 57.7,58.77 56.57,58.77 55.99,58.19 55.99,57.05 55.12,56.19 54.36,56.19 53.59,55.42 53.59,51.11 52.96,50.47 52.18,49.69 U3.5
END_STOP_Y_2  (via drill 0.35)
  Top 0.152: v49.4,49.96 49.4,50.72 50.16,51.49 52.32,51.49 52.83,51.99 52.83,52.5 52.45,52.88 51.05,52.88 50.55,52.88 50.16,52.88 49.78,53.26 49.78,55.67 50.42,56.31 P1.28 | v55.25,49.84 55.39,49.69 U3.12
  Bottom 0.152: v49.4,49.96 55.12,49.96 v55.25,49.84
END_STOP_Y_2_IN  (via drill 0.35)
  Top 0.152: X9.1 78.7,63.84 R5.1 | U3.11 54.76,48.42 v54.74,48.18 | IC1.4 61.09,54.51 v61.09,55.17
  Bottom 0.152: 60.9,51.04 61.21,51.36 65.72,55.87 67.63,55.87 68.58,56.82 68.58,62.15 70.42,64 70.42,65.51 70.56,65.64 72.27,65.64 72.4,65.51 72.4,63.92 73.42,62.9 77.76,62.9 X9.1 | v61.09,55.17 61.09,53.7 61.14,53.64 61.14,51.28 60.9,51.04 | 60.9,51.04 60.9,47.92 59.7,46.72 59.45,46.47 56.45,46.47 v54.74,48.18
END_STOP_Z_1
  Top 0.152: U3.6 52.18,48.42 53.91,50.15 53.91,54.9 54.9,55.89 56.48,55.89 58.22,57.63 58.22,58.32 59.23,59.33 59.93,59.33 60.2,59.61 60.4,59.8 60.76,60.17 60.76,60.86 61.52,61.62 64.71,61.62 65.13,61.62 65.69,61.06 65.99,61.06 66.54,61.62 | P1.13 68.38,61.62 66.54,61.62 | 66.4,61.47 66.54,61.62
END_STOP_Z_1_IN  (via drill 0.35)
  Top 0.152: X7.1 62.35,63.99 R3.1 | U3.7 52.81,47.15 v52.83,47.17
  Bottom 0.152: X7.1 63.01,64.29 64.52,62.79 66.55,62.79 66.8,62.54 66.8,61.88 65.91,60.99 65.91,57.2 65.15,56.44 63.4,56.44 63.16,56.2 62.61,56.2 62.48,56.2 61.26,56.2 60.53,55.47 60.53,48.01 59.44,46.91 59.34,46.82 57.17,46.82 55.25,48.74 53.39,48.74 52.83,48.18 v52.83,47.17
END_STOP_Z_2
  Top 0.152: P1.18 63.61,58.77 61.65,58.77 61.07,58.19 61.07,57.13 60.38,56.45 59.32,56.45 57.79,54.92 57.79,53.65 57.64,53.5 U3.15
END_STOP_Z_2_IN
  Top 0.152: U3.14 55.14,52.23 54.74,52.63 54.74,54.81 55.2,55.28 57.71,55.28 59.19,56.75 60.26,56.75 60.76,57.26 60.76,58.32 61.55,59.11 69.06,59.11 69.14,59.03 70.63,59.03 70.64,59.03 71.1,59.03 72.56,59.03 73.53,60 73.53,61.27 73.79,61.52 75.88,61.52 76.13,61.77 85.41,61.77 85.42,61.76 87.5,61.76 R6.1 88.18,64.06 X10.1
FAN2  (via drill 0.35)
  Top 0.152: v19.05,49.58 19.22,49.41 U1.16 | v16.64,5 17.53,4.12 27.81,4.12 29.62,5.92 30.2,5.92 30.75,6.47 41.8,6.47 42.55,5.72 43.81,5.72 43.87,5.77 43.94,5.77 44.12,5.95 72.34,5.95 73.56,7.16 81.54,7.16 82.81,8.43 83.44,8.43 84.49,8.43 84.51,8.42 88.84,8.42 89.38,8.96 89.38,8.98 Q4.1
  Top 0.254: R61.2 88.8,10.7 Q4.1
  Bottom 0.152: v16.64,5 16.64,21.51 16.07,22.09 16.07,39.1 17.09,40.13 17.09,45.34 19.05,47.3 v19.05,49.58
FAN3  (via drill 0.35)
  Top 0.152: v17.53,5.51 17.53,5.39 18.42,4.5 27.43,4.5 29.16,6.23 30.08,6.23 30.62,6.77 41.92,6.77 42.67,6.02 43.69,6.02 43.92,6.25 72.21,6.25 73.43,7.47 79.81,7.47 81.03,8.69 81.03,9.96 81.79,10.72 | v19.94,49.58 19.94,48.04 U1.17 | 82.42,10.72 87.25,10.72 90.42,13.89 R60.2
  Top 0.254: R60.2 93.47,13.03 93.47,10.23 Q5.1 | 81.79,10.72 82.42,10.72
  Bottom 0.152: v19.94,49.58 19.94,47.42 17.4,44.88 17.4,39.8 16.38,38.79 16.38,22.2 16.94,21.64 16.94,6.1 v17.53,5.51
FAULT_E  (via drill 0.35)
  Top 0.152: IC21.20 63.36,32.36 63.9,32.89 65.93,32.89 66.47,32.89 v66.8,32.56 66.69,32.68 R42.1 | P2.18 65.91,8.09 v65.91,7.42
  Bottom 0.152: v66.8,32.56 66.93,32.56 68.33,31.17 68.33,9.07 66.67,7.42 v65.91,7.42
FAULT_H  (via drill 0.35)
  Top 0.152: IC22.20 76.61,30.77 76.61,32.11 77.11,32.61 79.8,32.61 v79.88,32.69 v79.89,32.7 R46.1 | v74.93,14.02 76.2,12.75 76.2,10.5 P2.8
  Bottom 0.152: v74.93,14.02 74.93,22.66 77.22,24.94 77.22,29.46 79.88,32.13 v79.88,32.69
FAULT_X  (via drill 0.35)
  Top 0.152: R30.1 27.05,33.68 v27.05,32.56 25.97,32.56 25.93,32.61 24.24,32.61 23.81,32.18 IC18.20 | P2.10 73.84,8.49 73.84,8.31 72.09,6.56 65.56,6.56 65.55,6.57 43.77,6.57 43.56,6.35 42.82,6.35 42.1,7.07 30.14,7.07 v29.85,6.78
  Bottom 0.152: v27.05,32.56 28.83,30.79 28.83,23.67 27.81,22.66 27.81,8.81 v29.85,6.78
FAULT_Y  (via drill 0.35)
  Top 0.152: P2.9 73.53,10.72 73.53,8.43 71.96,6.86 65.68,6.86 65.63,6.91 v43.05,6.91 | R34.1 40.26,33.69 v40.26,32.56 40.13,32.69 37.47,32.69 37.01,32.24 IC19.20
  Bottom 0.152: v40.26,32.56 40.51,32.31 40.51,29.05 41.48,28.08 41.48,26.64 41.53,26.59 41.53,24.29 38.91,21.68 38.91,16.64 43.05,12.5 v43.05,6.91
FAULT_Z  (via drill 0.35)
  Top 0.152: IC20.20 50.21,31.5 50.04,31.67 50.04,32.31 50.55,32.82 53.09,32.82 | R38.1 53.54,33.27 53.09,32.82 | v53.47,32.44 53.09,32.82 | v56.39,44.25 56.98,44.84 56.98,44.98 58.67,46.67 v58.67,47.68
  Bottom 0.152: P1.24 58.45,59.25 59.94,59.25 61.07,60.38 61.07,60.73 61.65,61.31 63.07,61.31 63.5,60.88 63.5,57.2 63.1,56.8 63.1,56.74 61.04,56.74 59.13,54.83 59.13,52.1 58.88,51.84 58.88,47.88 v58.67,47.68 | v53.47,32.44 53.9,32.01 54.97,32.01 55.29,32.33 55.29,32.79 54.97,33.12 54.94,33.12 53.47,34.6 53.47,37.52 56.39,40.44 v56.39,44.25
GND  (via drill 0.35)  (6 unrouted)
  Top 0.152: D6.A 14.57,10.24 v14.99,9.83 | C63.2 13.9,30.65 R47.1 12.63,29.26 | U1.14 18.59,54.58 v19.3,55.3 | C22.2 16.83,44.58 R21.1 | C36.2 22.06,35.78 v21.97,35.99 | C35.1 20.54,33.11 v20.83,32.82 | C34.2 18,36.08 v18.03,35.87 | IC13.3 21.3,39.13 v21.34,39.17 | IC8.3 22.01,41.67 v22.23,41.45 | C18.2 25.01,46.41 24.56,46.41 23.37,46.41 22.86,46.91 18.29,46.91 17.78,47.42 v17.91,47.42 | C32.2 12.95,38.41 13.4,38.85 Q2.1 | C38.2 28.41,36.03 v28.45,35.99 | C40.2 31.2,36.04 v31.24,35.99 | C41.1 34.04,33.47 v34.04,32.82 | C42.2 35.26,35.66 v35.05,35.87 35.43,36.25 37.08,36.25 37.8,35.53 C43.2 | C44.2 41.61,35.91 v41.53,35.99 | C46.2 44.4,35.92 v44.32,35.99 | C47.1 47.24,33.46 v47.24,32.82 | C48.2 48.46,35.81 v48.51,35.87 48.64,35.99 50.55,35.99 51,35.54 C49.2 | C50.2 54.81,35.94 v54.86,35.99 | C52.2 57.53,35.08 v57.53,35.99 | C53.1 60.09,33.18 v60.45,32.82 | C54.2 61.61,35.34 v60.96,35.87 64.01,35.87 64.15,35.72 C55.2 | IC16.3 60.8,39.13 v60.96,39.29 | IC11.3 60.75,41.67 v60.97,41.46 | U9.8 66.75,37.97 v67.31,38.02 | v70.1,38.41 70.1,40.25 C28.2 68.68,41.67 C27.2 | IC17.3 74.26,39.13 v74.42,39.29 | IC12.3 74.2,41.67 v74.55,41.33 | C62.2 v81.16,36.11 v81.15,36.12 | U10.8 v79.89,36.63 v79.88,36.63 | C61.2 77.35,35.99 77.22,36.12 v76.07,36.12 | C59.1 73.29,33.06 v73.53,32.82 | C60.2 v74.81,35.86 v74.8,35.87 | U6.8 27.14,38.88 v27.31,39.04 27.85,39.59 C30.2 28.73,39.34 29.69,39.34 30.02,39.02 30.02,37.79 29.69,37.47 29.16,37.47 29.08,37.39 30.1,37.39 30.43,37.72 C31.2 | C65.1 26.63,31.26 v26.04,30.66 | C67.1 40.76,31.67 v42.16,31.67 | C69.1 52.92,31.26 v52.45,30.79 | C71.1 67.23,31.8 v68.58,31.8 | U8.8 53.72,38.02 v55.25,38.02
  Top 0.152: v56.64,37.9 56.78,38.04 56.78,40.31 | 56.78,40.31 C26.2 | C25.2 55.28,41.42 56.39,40.31 56.78,40.31 | U2.1 U2.2 31.64,57.72 P1.44 | C29.2 v81.16,42.46 v81.15,42.47 | U10.13 77.27,44.82 v77.09,45.01 | IC7.3 73.79,44.63 v74.04,44.63 | v40.26,46.53 39.5,46.53 37.72,44.76 U7.13 | C4.2 37.47,55.93 37.08,56.31 v36.2,56.31 | C5.2 41.27,53.65 v41.91,53.01 | IC15.3 47.72,39.13 v47.88,39.29 | IC10.3 48.04,41.67 v48.26,41.45 | IC4.3 33.82,45.49 C19.2 32.65,45.14 31.79,45.14 31.35,44.7 30.56,44.7 29.12,43.27 29.12,43.22 28.96,43.05 v28.96,42.22 | v41.91,38.41 40.9,38.41 U7.8 40.24,37.95 40.24,39.57 38.23,41.58 34.85,41.58 34.76,41.67 IC9.3 | v43.56,38.41 43.63,38.48 C24.2 | C56.2 67.94,35.08 v67.94,35.74 | C58.2 v70.75,35.73 v70.74,35.74 | v43.18,46.53 43.05,45.01 v42.04,44.5 41.61,43.19 C23.2 | C89.2 27.78,18.06 C84.2 | v57.79,52.88 58.15,53.25 C8.2 60.87,53.25 61.01,53.11 61.01,52.89 IC1.3 | IC14.3 34.51,39.13 v34.54,39.17 | v51.31,42.34 50.92,42.73 U8.13 50.92,45.26 51.36,45.7 U3.8 | R20.2 64.52,46.66 v65.15,47.3 | IC5.3 47.66,44.21 v47.88,43.99 | C78.2 C88.2 | U9.13 64.07,42.66 v64.01,42.6 | IC2.3 61.23,48.94 60.17,47.88 59.71,47.88 58.67,48.92 C12.2 | R16.2 62.74,50.49 62.74,51.11 63.54,51.11 63.58,51.15 64.81,51.15 v65.07,51.28 | v61.21,44.25 60.21,44.25 IC6.3 | v47.88,53.14 47.93,53.09 C7.2 | Q5.2 95.95,8.11 v96.01,8.05 | v92.2,8.05 91.85,8.4 Q4.2 | v52.32,55.8 52.32,56.06 53.14,56.88 53.14,58.32 53.34,58.52 53.34,62.28 v52.83,62.79
  Top 0.254: R61.1 P2.2 | IC18.36 19.16,24.78 R48.1 19.81,25.17 IC18.1 IC18.36 | IC18.36 19.16,26.92 IC18.35 | IC18.35 19.39,27.07 | IC18.35 20.81,27.07 IC18.TP 22.64,27.74 23.62,27.74 | 24.31,24.94 IC18.10 24.31,26.98 | 32.68,27.07 34.01,27.07 IC19.TP 36.51,27.07 36.96,27.07 | 32.68,27.07 IC19.35 32.51,26.72 IC19.36 32.62,26.31 R50.1 | 32.68,27.07 32.68,26.4 33.01,26.08 IC19.1 | R51.1 37.51,24.96 IC19.10 | IC19.10 IC19.11 38.16,26.92 IC19.12 36.96,27.07 | 36.96,27.07 37.51,26.52 IC19.10 | IC20.35 47.21,27.07 IC20.TP 49.71,27.07 50.16,27.07 | IC20.35 45.71,26.72 IC20.36 45.56,24.91 R52.1 46.21,24.76 IC20.1 45.71,26.42 IC20.35 | R53.1 50.71,24.97 IC20.10 | IC20.10 IC20.11 51.21,26.72 IC20.12 50.16,27.07 | 50.16,27.07 50.71,26.53 IC20.10 | 23.62,27.74 24.31,27.43 24.31,26.98 | 24.31,26.98 24.71,26.57 IC18.11 | 24.64,27.1 24.67,27.07 IC18.12 24.29,27.07 23.62,27.74 | 12.63,29.26 12.63,28.51 12.57,28.45 12.57,27.64 Q3.3 | R18.2 85.88,48.68 U5.6 87.68,48.68 87.91,48.44 87.91,48.28 v88.77,47.42
  Top 0.381: 24.31,24.94 R49.1 | 32.36,24.78 R50.1 | 38.16,24.91 R51.1 | IC21.35 58.86,26.85 58.86,26.72 IC21.36 IC21.1 59.36,24.9 R54.1 | IC21.12 64.36,26.85 64.36,26.72 IC21.11 IC21.10 63.86,24.84 R55.1 | IC22.35 72.06,26.85 72.06,26.72 IC22.36 IC22.1 72.56,24.75 R56.1 | IC22.12 77.56,26.85 77.56,26.72 IC22.11 | IC22.11 IC22.10 | IC22.11 77.71,24.78 R57.1 | IC21.TP 61.36,28.57 IC21.24 | IC22.TP 74.56,28.57 IC22.24 | IC20.TP 47.65,29.13 48.21,29.68 IC20.24 | IC19.TP 35.01,28.57 IC19.24 | IC18.TP 21.81,28.57 IC18.24
  Top 0.508: C74.2 27.6,16.63 C89.2 | C85.2 40.8,16.63 C90.2 | C86.2 54.18,18.06 C91.2 | C87.2 67.15,16.63 C92.2 | C88.2 80.35,16.63 C93.2 | D4.A 94.68,43.08 v93.98,43.08 LED2.C | C20.2 88.77,45.12 v88.77,47.42 | R23.2 85.36,44.77 v85.34,44.76
  Top 0.762: X10.2 90.13,62.12 89.42,61.4 89.36,61.4 89.35,61.39 88.01,61.39 87.58,60.96 C1.2 87.22,60.32 P1.1 | C2.2 95.91,58.5 v95.88,58.47 | C79.- 17.78,19.86 v19.81,19.86 | v19.18,18.72 17.43,18.72 C79.- | v19.81,19.1 C79.- | v19.18,19.48 17.4,19.48 C79.-
  Top 0.813: v84.58,55.3 84.58,54.03 C11.2 | C11.2 84.45,54.41 v85.34,55.3 85.34,57.36 84.96,57.74 | v84.58,55.3 84.58,55.68 v84.96,56.06 84.96,56.82 | v84.58,55.3 84.2,55.68 v84.2,56.06 84.96,56.82 | 84.96,56.82 84.96,57.74 | 84.96,57.74 P1.2 | 84.96,57.74 83.82,56.59 v83.82,55.3 83.82,54.54 C11.2 | IC20.TP 48.21,28.32 | 58.86,26.85 60.14,26.85 IC21.TP 63.08,26.85 64.36,26.85 | 72.06,26.85 73.34,26.85 IC22.TP 76.28,26.85 77.56,26.85
  Top 1.524: P1.1 P1.2
  Bottom 0.152: v51.31,42.34 49.4,44.25 49.14,44.25 48.36,43.47 47.65,43.47 47.44,43.68 | 47.44,43.68 47.3,43.82 46.68,43.82 46.25,44.25 43.05,44.25 43.05,44.37 v43.18,44.49 | v47.88,43.99 47.56,43.68 47.44,43.68 | v89.53,47.42 89.53,47.68 v89.92,48.06 | v89.15,48.06 89.15,47.8 v89.53,47.42 | v90.3,47.42 v89.53,47.42 | v88.77,47.42 v89.53,47.42 | v75.56,28.37 v74.8,28.37 v74.04,28.37 | v74.42,27.74 74.8,28.12 v75.18,27.74 | v75.18,29.01 74.8,28.63 v74.42,29.01 | v61.21,44.25 61.83,44.25 61.95,44.12 62.48,44.12 v64.01,42.6 | v57.79,52.88 55.88,52.88 54.61,51.61 50.42,51.61 49.91,51.11 49.89,51.13 48.92,51.13 48.9,51.11 47.88,51.11 47.5,51.49 47.5,52.76 v47.88,53.14 | v96.01,8.05 v92.2,8.05
  other vias: 20.96,29.01 21.72,29.01 22.48,29.01 23.24,29.01 21.34,28.37 22.1,28.37 22.86,28.37 20.96,27.74 21.72,27.74 22.48,27.74 23.24,27.74 34.16,29.01 34.93,29.01 35.69,29.01 36.45,29.01 34.54,28.37 35.31,28.37 36.07,28.37 34.16,27.74 34.93,27.74 35.69,27.74 36.45,27.74 60.45,29.01 61.21,29.01 61.98,29.01 62.74,29.01 60.83,28.37 61.59,28.37 62.36,28.37 60.45,27.74 61.21,27.74 61.98,27.74 62.74,27.74 73.66,29.01 75.95,29.01 73.66,27.74 75.95,27.74 47.37,29.01 48.13,29.01 48.9,29.01 49.66,29.01 47.75,28.37 48.51,28.37 49.28,28.37 47.37,27.74 48.13,27.74 48.9,27.74 49.66,27.74 69.72,16.56 70.48,16.56 71.25,16.56 72.01,16.56 70.1,15.93 70.87,15.93 71.63,15.93 69.72,15.29 70.48,15.29 71.25,15.29 72.01,15.29 29.34,16.31 30.1,16.31 30.86,16.31 31.62,16.31 29.72,15.67 30.48,15.67 31.24,15.67 29.34,15.04 30.1,15.04 30.86,15.04 31.62,15.04 45.97,15.16 45.21,15.16 44.45,15.16 43.69,15.16 45.59,15.8 44.83,15.8 44.07,15.8 45.97,16.43 45.21,16.43 44.45,16.43 43.69,16.43 55.63,16.69 56.39,16.69 57.15,16.69 57.91,16.69 56.01,16.05 56.77,16.05 57.53,16.05 55.63,15.42 56.39,15.42 57.15,15.42 57.91,15.42 14.35,4.88 14.35,5.64 14.35,6.4 14.35,7.16 14.99,5.26 14.99,6.02 14.99,6.78 15.62,4.88 15.62,5.64 15.62,6.4 15.62,7.16 15.62,7.93 15.62,8.69 15.62,9.45 14.35,7.93 14.35,8.69 14.35,9.45 14.99,7.54 14.99,8.31 14.99,9.07 24.26,60.38 25.02,60.38 25.78,60.38 26.54,60.38 24.64,59.74 25.4,59.74 26.16,59.74 24.26,59.11 25.02,59.11 25.78,59.11 26.54,59.11 37.21,49.33 41.91,50.09 14.99,57.84 14.99,58.6 14.99,59.36 14.99,60.12 15.62,58.22 15.62,58.98 15.62,59.74 14.73,39.93 14.73,40.69 14.73,41.45 14.73,42.22 15.37,40.31 15.37,41.07 15.37,41.83 14.73,24.31 14.73,25.07 14.73,25.83 14.73,26.59 15.37,24.69 15.37,25.45 15.37,26.21 28.32,48.31 13.97,56.31 77.34,47.17 78.36,47.17 79.38,47.17 78.87,46.66 77.85,46.66 67.94,49.33 68.71,49.33 67.56,48.69 68.33,48.69 69.09,48.69 67.56,53.26 67.56,54.03 68.2,52.88 68.2,53.65 68.2,54.41 32.64,55.55 32.96,40.76 67.44,2.97 68.2,2.97 68.96,2.97 69.72,2.97 67.82,2.34 68.58,2.34 69.34,2.34 67.44,1.7 68.2,1.7 68.96,1.7 69.72,1.7 80.77,2.59 81.53,2.59 82.3,2.59 83.06,2.59 81.15,1.96 81.91,1.96 82.68,1.96 80.77,1.32 81.53,1.32 82.3,1.32 83.06,1.32 54.86,51.61 27.94,2.85 28.7,2.85 29.46,2.85 30.23,2.85 28.32,2.21 29.08,2.21 29.85,2.21 27.94,1.58 28.7,1.58 29.46,1.58 30.23,1.58 41.27,2.72 42.04,2.72 42.8,2.72 43.56,2.72 41.66,2.08 42.42,2.08 43.18,2.08 41.27,1.45 42.04,1.45 42.8,1.45 43.56,1.45 54.48,2.85 55.25,2.85 56.01,2.85 56.77,2.85 54.86,2.21 55.63,2.21 56.39,2.21 54.48,1.58 55.25,1.58 56.01,1.58 56.77,1.58 88.27,16.43 89.03,16.43 89.79,16.43 90.55,16.43 88.65,15.8 89.41,15.8 90.17,15.8 88.27,15.16 89.03,15.16 89.79,15.16 90.55,15.16
  pour Top (rank 6): -0.13,70.66 99.31,70.66 99.31,-0.96 -0.13,-0.96
  pour Bottom (rank 6): -0.89,71.3 99.82,71.3 99.82,-0.71 -0.89,-0.71
  pour Top: 11.81,27.48 16,27.48 16.64,26.85 17.91,25.58 17.91,24.56 17.91,24.05 17.4,23.55 11.68,23.55 11.68,27.48
  pour Top: 32,21.13 27.31,21.13 26.92,20.75 26.92,14.91 27.31,14.53 27.69,14.15 31.88,14.15 33.02,15.29 33.02,19.48 33.02,20.12
  pour Top: 71.75,21.13 67.06,21.13 66.67,20.75 66.67,14.91 67.06,14.53 67.44,14.15 71.63,14.15 72.77,15.29 72.77,19.48 72.77,20.12
  pour Top: 58.42,21.13 53.72,21.13 53.34,20.75 53.34,14.91 53.72,14.53 54.1,14.15 58.29,14.15 59.44,15.29 59.44,19.48 59.44,20.12
  pour Top: 45.47,21.13 40.77,21.13 40.39,20.75 40.39,14.91 40.77,14.53 41.15,14.15 45.34,14.15 46.48,15.29 46.48,19.48 46.48,20.12
  pour Top: 14.6,67.62 20.7,67.62 23.37,64.95 23.37,57.33 24.89,55.8 32.38,55.8 34.04,54.15 34.04,48.06 36.07,46.03 81.41,46.03 82.55,44.88 82.55,33.83 15.24,33.83 14.6,34.47 14.6,37.52 16,38.91 16.64,38.91 17.4,39.68 17.4,43.74 16.38,44.76 14.6,46.53 14.6,55.68 15.62,56.69 18.03,56.69 19.43,58.09 19.43,58.34 19.43,61.39 18.54,62.28 18.16,62.66 15.62,62.66 14.6,63.68
HEATER_E  (via drill 0.35)
  Top 0.152: v19.43,50.47 20.52,51.56 U1.11 | R47.2 13.4,28.84 Q3.4 14.31,28.08 v14.35,28.12
  Bottom 0.152: v19.43,50.47 18.92,50.47 18.42,49.96 18.42,49.45 18.49,49.38 18.49,49.35 18.67,49.18 18.67,47.4 18.14,46.87 18.11,46.87 16.76,45.52 16.76,40.31 14.6,38.15 14.6,28.37 v14.35,28.12
HEATER_E_OUT
  Top 0.254: C63.1 10.68,30.81 D5.A
  Top 0.508: R58.1 9.16,21.89 LED4.C
  Top 0.813: LED4.C 8.96,22.91 Q3.8
  Top 2.032: 9.73,26.16 Q3.TH 9.73,26.16 | D5.A 6.04,26.16 X13.2 | 9.73,26.16 X13.2 | Q3.7 6.98,26.16 X13.2 | Q3.8 5.94,24.27 X13.2 | Q3.6 4.71,26.81 X13.2 | Q3.5 5.97,28.08 X13.2
HEATER_H
  Top 0.152: U1.9 21.85,53.84 21.85,54.75 19.74,56.87 13.74,56.87 13.69,56.82 12.83,56.82 12.45,57.2 12.45,61.14 12.76,61.46 Q1.4 15.37,61.46 16.08,61.46 R7.2
HEATER_HBP
  Top 0.152: U1.10 21.18,54.83 20.07,55.93 19.56,55.93 19.55,55.93 16.38,55.93 14.09,53.64 R21.2 14.09,44.27 Q2.4
I2C2_SCL  (via drill 0.35)
  Top 0.152: U1.26 25.72,49.27 26.42,49.96 29.72,49.96 | 29.72,49.96 30.37,49.31 U2.6 | v30.1,50.34 29.72,49.96
  Bottom 0.152: v30.1,50.34 31.12,51.36 47.17,51.36 47.4,51.13 47.42,51.13 47.75,50.8 49.02,50.8 49.05,50.82 49.76,50.82 49.78,50.8 56.72,50.8 58.42,52.5 58.42,55.19 60.56,57.33 60.56,58.82 P1.19
I2C2_SDA  (via drill 0.35)
  Top 0.152: U1.27 26.38,49.17 26.54,49.33 28.83,49.33 29.1,49.06 29.1,48.69 | 29.1,48.69 U2.5 | 29.1,48.69 29.1,48.31 29.87,47.54 29.87,47.4 30.01,47.27 30.73,47.27 30.86,47.4 30.86,47.68 30.99,47.8 v30.99,50.09
  Bottom 0.152: v30.99,50.09 31.88,50.98 46.99,50.98 47.24,50.72 47.4,50.72 47.63,50.5 49.15,50.5 49.17,50.52 49.63,50.52 49.66,50.5 56.98,50.5 58.83,52.34 58.83,55.07 61.54,57.78 P1.20
IREF_E_RAW  (via drill 0.35)
  Top 0.152: U1.21 v22.47,49.58 v22.48,49.58 | v65.41,35.99 65.42,36.1 R41.2
  Bottom 0.152: v65.41,35.99 65.15,36.5 65.15,39.93 66.47,41.25 66.47,42.42 66.23,42.66 65.29,42.66 64.36,41.74 63,41.74 61.06,43.68 60.88,43.68 60.25,44.31 60.25,44.49 59.34,45.39 54.74,45.39 54.38,45.04 53.19,45.04 49.78,48.44 47.62,48.44 46.61,47.42 39.83,47.42 38.48,46.08 36.96,46.08 36.63,46.41 35.36,46.41 34.92,45.97 25.86,45.97 24.13,44.25 22.73,44.25 21.97,45.01 21.97,48.06 22.48,48.57 v22.48,49.58
IREF_H_RAW  (via drill 0.35)
  Top 0.152: U1.22 23.13,50.32 v23.11,50.34 | v78.61,36.12 78.61,34.82 R45.2
  Bottom 0.152: v78.61,36.12 78.61,40.95 75.37,44.19 75.09,44.19 74.76,44.52 74.76,44.8 73.41,46.15 61.39,46.15 61.02,45.78 54.6,45.78 54.16,45.34 53.64,45.34 50.16,48.82 47.32,48.82 46.56,48.06 39.9,48.06 38.23,46.38 37.08,46.38 36.68,46.79 35.31,46.79 34.8,46.28 25.65,46.28 23.96,44.58 22.88,44.58 22.56,44.91 22.56,48.14 23.11,48.69 v23.11,50.34
IREF_X_RAW  (via drill 0.35)
  Top 0.152: U1.18 20.52,50.27 v20.45,50.34 | v25.78,35.99 25.78,35.16 R29.2
  Bottom 0.152: v20.45,50.34 20.45,49.86 20.5,49.81 20.5,46.53 20.5,43.53 20.49,43.52 20.49,42.05 21.72,40.82 24.64,40.82 24.64,40.81 24.83,40.81 25.78,39.86 v25.78,35.99
IREF_Y_RAW  (via drill 0.35)
  Top 0.152: U1.19 21.18,49.49 v21.08,49.58 | v38.99,35.99 38.99,35.15 R33.2
  Bottom 0.152: v21.08,49.58 21.08,43.69 20.79,43.4 20.79,42.68 21.3,42.18 23.59,42.18 26.13,44.73 33.78,44.73 34.04,44.73 34.78,44.73 35.18,44.32 37.92,44.32 40.05,42.19 40.05,41.73 39.78,41.45 39.78,40.37 40.64,39.51 40.64,37.96 38.99,36.31 v38.99,35.99
IREF_Z6
  Top 0.152: R37.1 C49.1 R36.2
IREF_Z7
  Top 0.152: R41.1 C55.1 R40.2
IREF_Z8
  Top 0.152: R29.1 C37.1 R28.2
IREF_Z9
  Top 0.152: R33.1 C43.1 R32.2
IREF_Z10
  Top 0.152: R45.1 C61.1 R44.2
IREF_Z_RAW  (via drill 0.35)
  Top 0.152: U1.20 21.84,50.22 v21.72,50.34 | v52.32,35.87 52.32,35.12 R37.2
  Bottom 0.152: v21.72,50.34 21.72,48.23 21.54,48.06 21.54,43.72 21.1,43.27 21.1,42.81 21.42,42.49 23.26,42.49 25.8,45.03 34.91,45.03 35.28,44.66 39.96,44.66 40.97,45.67 43.65,45.67 43.78,45.54 47.02,45.54 47.18,45.71 47.24,45.77 47.37,45.9 47.47,45.9 47.65,46.07 47.94,46.07 48.63,46.07 49.34,45.37 49.62,45.37 52.47,42.52 52.81,42.52 53.13,42.19 53.13,41.73 52.32,40.92 v52.32,35.87
N$1  (via drill 0.35)
  Top 0.152: U1.6 23.77,52.51 v23.78,52.5
  Bottom 0.152: v23.78,52.5 23.78,51.48 23.48,51.18 18.87,51.18 SV1.1
N$2
  Top 0.152: C45.2 43.63,34.3 43.63,33.15 43.94,32.84 45.34,32.84 46.71,31.47 IC20.27
N$3
  Top 0.254: IC20.14 52.27,28.07 52.97,27.37 R53.2
N$4
  Top 0.254: IC20.33 43.77,28.07 43.37,27.67 43.37,25.2 R52.2
N$5
  Top 0.152: IC20.23 48.71,32.13 48.46,32.38 C48.1 49.73,35.04 R36.1
N$6
  Top 0.152: C45.1 43.33,33.31 43.33,33.02 43.81,32.54 44.84,32.54 46.21,31.17 IC20.28
N$8
  Top 0.152: R64.2 10.9,1.08 LED7.C
N$12  (via drill 0.35)
  Top 0.152: IC20.3 47.21,24.88 47.05,24.72 47.05,23.95 v47.44,23.56 | IC15.4 45.32,39.06 v45.82,38.56
  Bottom 0.152: v45.82,38.56 45.82,38.53 46.12,38.23 46.12,24.89 v47.44,23.56
N$13
  Top 0.152: R35.1 C47.2 47.71,34.29 47.71,33.14 47.8,33.05 47.8,32.59 47.71,32.5 IC20.25
N$14
  Top 0.254: IC20.29 45.56,30.46
  Top 0.508: C68.1 44.76,31.26 45.56,30.46
N$15  (via drill 0.35)
  Top 0.152: v47.66,24.47 47.71,24.52 47.71,24.85 47.6,24.96 47.6,25.46 47.71,25.57 IC20.4 | IC10.4 45.31,41.66 v44.62,41.66
  Bottom 0.152: v47.66,24.47 46.43,25.71 46.43,40.59 45.37,41.66 v44.62,41.66
N$16  (via drill 0.35)
  Top 0.152: IC20.5 v48.21,25.21 | v50.24,38.99 50.24,37.9 U8.3
  Bottom 0.152: v50.24,38.99 50.19,38.94 50.19,30.38 50.42,30.15 50.42,27.42 v48.21,25.21
N$17  (via drill 0.35)
  Top 0.152: IC20.18 51.36,31.32 v52.09,32.05 | U8.2 49.63,39.24 49.99,39.6 50.72,39.6 v51,39.88
  Bottom 0.152: v52.09,32.05 51.25,32.89 51.25,39.62 v51,39.88
N$18  (via drill 0.35)
  Top 0.152: IC20.19 50.75,30.76 50.75,31.81 v50.82,31.88 | v49.98,40.26 49.48,40.26 48.97,39.75 U8.1
  Bottom 0.152: v50.82,31.88 50.82,39.27 49.98,40.11 v49.98,40.26
N$19
  Top 0.152: U8.7 52.88,40.08 51.61,41.35 50.97,41.35 50.22,42.1 46.58,42.1 46.21,41.73 46.21,40.96 46.8,40.37 IC10.1
N$20
  Top 0.152: IC10.2 47.91,41.02 48.03,40.9 48.49,40.9 49.02,41.42 50.47,41.42 50.85,41.04 51.48,41.04 52.32,40.21 52.32,38.35 52.32,38.34 52.32,37.95 U8.6
N$22
  Top 0.152: IC15.2 47.9,38.48 48.66,39.24 48.66,39.95 49.52,40.81 50.21,40.81 50.59,40.43 51.23,40.43 51.56,40.11 51.56,39.65 50.92,39.01 U8.4
N$23
  Top 0.152: R17.2 64.27,49.45 U4.7 65.11,49.45 64.16,50.4
  Top 0.3: 64.16,50.4 R16.1 R17.2
N$24
  Top 0.152: IC15.1 46.8,37.83 46.43,38.2 46.43,39.41 46.77,39.75 47.37,39.75 48.21,40.59 48.62,40.59 49.14,41.12 49.78,41.12 | 49.78,41.12 49.88,41.12 | 49.88,41.12 50.34,41.12 50.72,40.74 51.36,40.74 52.02,40.08 52.02,39.55 51.58,39.12 U8.5 | 49.78,41.12 49.88,41.12
N$25
  Top 0.152: C16.2 72.83,48.23 72.83,49.9
  Top 0.254: U4.5 72.66,49.95 72.77,49.84 72.83,49.9 72.9,49.96 L2.P$2
  Top 1.524: D2.C 72.24,51.6 L2.P$2
N$26
  Top 0.152: C46.1 R35.2 45.67,33.61 47.01,32.26 47.06,32.26 47.21,32.11 IC20.26
N$27
  Top 0.152: C51.2 56.78,34.3 56.78,33.15 57.09,32.84 58.67,32.84 59.86,31.66 IC21.27
N$28
  Top 0.254: IC21.14 65.42,28.07 66.25,27.24 66.25,24.75 R55.2
N$29
  Top 0.254: IC21.33 57.66,28.07 57.55,27.96 57.53,27.96 57.14,27.57 R54.2
N$30
  Top 0.152: IC21.23 61.86,32.13 61.61,32.38 C54.1 62.88,35.04 R40.1
N$31
  Top 0.152: C51.1 56.48,33.31 56.48,33.02 56.96,32.54 58.29,32.54 59.36,31.47 IC21.28
N$32  (via drill 0.35)
  Top 0.152: IC21.3 60.36,24.88 60.2,24.72 60.2,23.95 v60.59,23.56 | IC16.4 58.47,39.06 v58.97,38.56
  Bottom 0.152: v58.97,38.56 58.97,38.53 59.27,38.23 59.27,24.89 v60.59,23.56
N$35